# Altium schematic sheet I2C-Motion-sensor.SchDoc: =ProjectTitle
size 297 x 209 mm; Address1: Address1; Address2: Address2; Address3: Address3; Address4: Address4; SheetNumber: 12; SheetTotal: 17; Scale: 1:1; DocumentType: Схема электрическая принципиальная
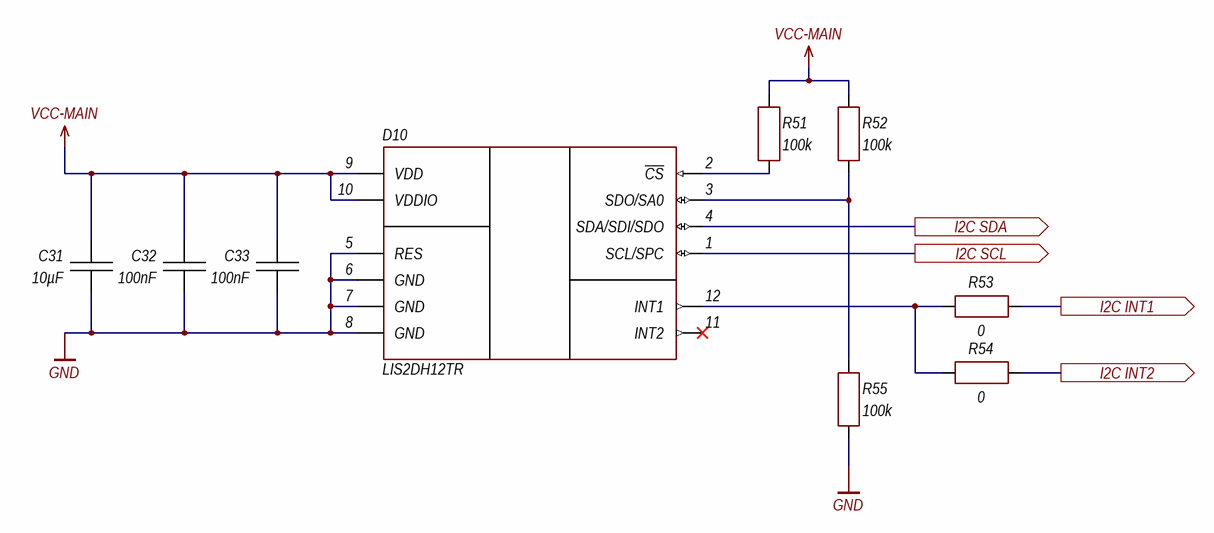
[diagram p0: I2C-Motion-sensor.SchDoc]

## Parts
C31  10µF  [CH0402C]
C32  100nF  [CH0402C]
C33  100nF  [CH0402C]
D10  LIS2DH12TR  [12-LGA (2x2mm)]
R51  100k  [CH0402R]
R52  100k  [CH0402R]
R53  0  [CH0402R]
R54  0  [CH0402R]
R55  100k  [CH0402R]

## Ports
I2C INT1 (out), I2C INT2 (out), I2C SCL (out), I2C SDA (out)

## Nets
GND: C31.1 C32.1 C33.1 D10.5(RES) D10.6(GND) D10.7(GND) D10.8(GND) R55.1
VCC-MAIN: C31.2 C32.2 C33.2 D10.9(VDD) D10.10(VDDIO) R51.2 R52.2
I2C INT1: R53.1 ; port I2C INT1
I2C INT2: R54.1 ; port I2C INT2
I2C SCL: D10.1(SCL/SPC) ; port I2C SCL
I2C SDA: D10.4(SDA/SDI/SDO) ; port I2C SDA
NetD10_2: D10.2(~{CS}) R51.1
NetD10_3: D10.3(SDO/SA0) R52.1 R55.2
NetD10_12: D10.12(INT1) R53.2 R54.2

Not connected (* = marked no-connect by the designer): D10 11(INT2)*

## Notes on the sheet
- Изм.
- Лист
- № докум.
- Подп.
- Дата
- Копировал
- Формат А4

## Library data of the parts
C31-C33 = Capacitor: Manufacturer: *; Model: *; HelpURL: *; ComponentKind: *
  C31: Value: 10µF
  C32 C33: Value: 100nF
D10 = LIS2DH12TR: Motion sensor, I2C; Manufacturer: STMicroelectronics; Model: LIS2DH12TR; HelpURL: https://www.lcsc.com/product-detail/Motion-Sensors-Accelerometers_STMicroelectronics-LIS2DH12TR_C110926.html; ComponentKind: 1.71-3.6V, 4D/6D,±2/4/8/16 g , I2C
R51-R55 = Resistor: Manufacturer: *; Model: *; HelpURL: *; ComponentKind: *
  R51 R52 R55: Value: 100k
  R53 R54: Value: 0